# Altium schematic sheet G031_Dev.SchDoc
size A4
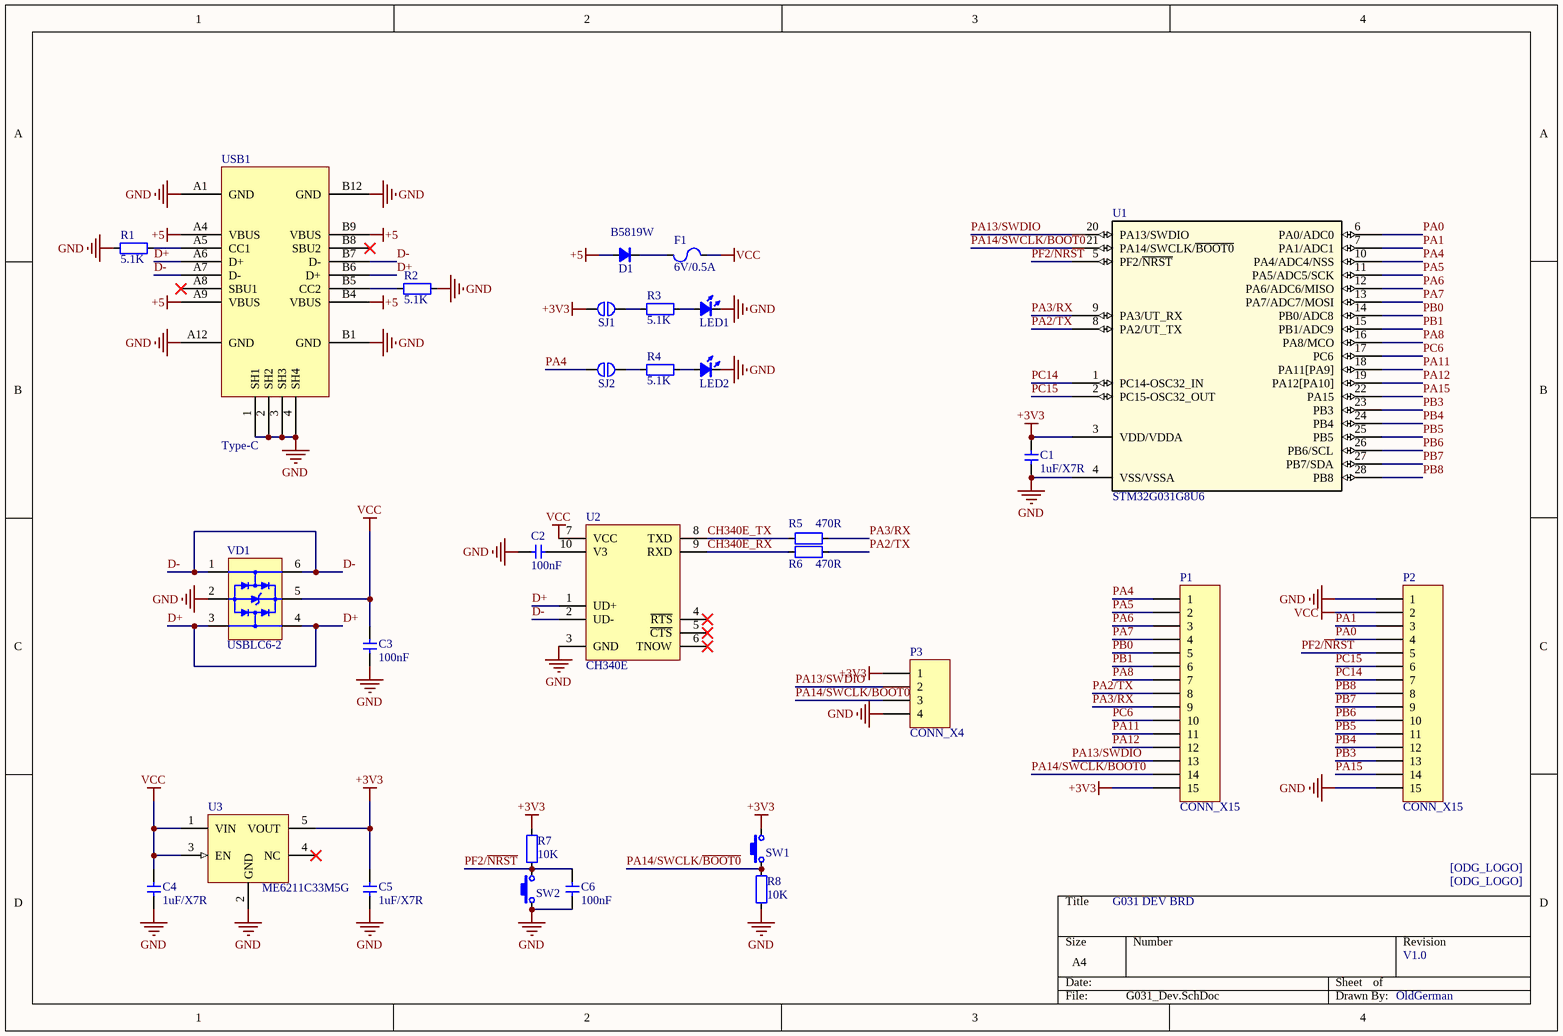
[diagram p0: G031_Dev.SchDoc]

## Parts
*1  ODG_LOGO  [ODG_LOGO]  (value not drawn)
*2  ODG_LOGO  [ODG_LOGO]  (value not drawn)
C1  1uF/X7R  [C0603]
C2  100nF  [C0603]
C3  100nF  [C0603]
C4  1uF/X7R  [C0603]
C5  1uF/X7R  [C0603]
C6  100nF  [C0603]
D1  B5819W  [SOD-323]
F1  6V/0.5A  [FUSE0603_0.5MM]
LED1  LED  [LED0603_GREEN]  (value not drawn)
LED2  LED  [LED0603_YELLOW]  (value not drawn)
P1  CONN_X15  [2.54MM_MALE_X15]
P2  CONN_X15  [2.54MM_MALE_X15]
P3  CONN_X4  [2.54mm_Male_x4]
R1  5.1K  [R0603]
R2  5.1K  [R0603]
R3  5.1K  [R0603]
R4  5.1K  [R0603]
R5  470R  [R0603]
R6  470R  [R0603]
R7  10K  [R0603]
R8  10K  [R0603]
SJ1  SJ_2P  [SJ_2P_MINI]  (value not drawn)
SJ2  SJ_2P  [SJ_2P_MINI]  (value not drawn)
SW1  Button-2P  [SWITCH_3X4_SMD]  (value not drawn)
SW2  Button-2P  [SWITCH_3X4_SMD]  (value not drawn)
U1  STM32G031G8U6  [UFQFPN28-4x4mm_ODG]
U2  CH340E  [TI MSOP-10 DGS]
U3  ME6211C33M5G  [ANALOG TSOT-23-5 UJ-5]
USB1  Type-C  [Type-C-TOP]
VD1  USBLC6-2  [MICROCHIP SOT-23-6 M6]

## Nets
+3V3: C1.1 C5.2 P1.15 P3.1 R7.1 SJ1.1 SW1.2 U1.3(VDD/VDDA) U3.5(VOUT)
+5: D1.1(A) USB1.A4(VBUS) USB1.A9(VBUS) USB1.B4(VBUS) USB1.B9(VBUS)
GND: C1.2 C2.1 C3.1 C4.1 C5.1 C6.1 LED1.2(K) LED2.2(K) P2.1 P2.15 P3.4 R1.1 R2.2 R8.2 SW2.1 U1.4(VSS/VSSA) U2.3(GND) U3.2(GND) USB1.1(SH1) USB1.2(SH2) USB1.3(SH3) USB1.4(SH4) USB1.A1(GND) USB1.A12(GND) USB1.B1(GND) USB1.B12(GND) VD1.2(GND)
VCC: C3.2 C4.2 F1.2 P2.2 U2.7(VCC) U3.1(VIN) U3.3(EN) VD1.5(VBUS)
CH340E_RX: R6.1 U2.9(RXD)
CH340E_TX: R5.1 U2.8(TXD)
D+: U2.1(UD+) USB1.A6(D+) USB1.B6(D+) VD1.3(I/O2) VD1.4(I/O2)
D-: U2.2(UD-) USB1.A7(D-) USB1.B7(D-) VD1.1(I/O1) VD1.6(I/O1)
PA0: P2.4 U1.6(PA0/ADC0)
PA1: P2.3 U1.7(PA1/ADC1)
PA2/TX: P1.8 R6.2 U1.8(PA2/UT_TX)
PA3/RX: P1.9 R5.2 U1.9(PA3/UT_RX)
PA4: P1.1 SJ2.1 U1.10(PA4/ADC4/NSS)
PA5: P1.2 U1.11(PA5/ADC5/SCK)
PA6: P1.3 U1.12(PA6/ADC6/MISO)
PA7: P1.4 U1.13(PA7/ADC7/MOSI)
PA8: P1.7 U1.16(PA8/MCO)
PA11: P1.11 U1.18(PA11[PA9])
PA12: P1.12 U1.19(PA12[PA10])
PA13/SWDIO: P1.13 P3.2 U1.20(PA13/SWDIO)
PA14/SWCLK/~{BOOT0}: P1.14 P3.3 R8.1 SW1.1 U1.21(PA14/SWCLK/~{BOOT0})
PA15: P2.14 U1.22(PA15)
PB0: P1.5 U1.14(PB0/ADC8)
PB1: P1.6 U1.15(PB1/ADC9)
PB3: P2.13 U1.23(PB3)
PB4: P2.12 U1.24(PB4)
PB5: P2.11 U1.25(PB5)
PB6: P2.10 U1.26(PB6/SCL)
PB7: P2.9 U1.27(PB7/SDA)
PB8: P2.8 U1.28(PB8)
PC6: P1.10 U1.17(PC6)
PC14: P2.7 U1.1(PC14-OSC32_IN)
PC15: P2.6 U1.2(PC15-OSC32_OUT)
PF2/~{NRST}: C6.2 P2.5 R7.2 SW2.2 U1.5(PF2/~{NRST})
NetC2_2: C2.2 U2.10(V3)
NetD1_2: D1.2(C) F1.1
NetLED1_1: LED1.1(A) R3.2
NetLED2_1: LED2.1(A) R4.2
NetR1_2: R1.2 USB1.A5(CC1)
NetR2_1: R2.1 USB1.B5(CC2)
NetR3_1: R3.1 SJ1.2
NetR4_1: R4.1 SJ2.2

Not connected (* = marked no-connect by the designer): U2 4(~{RTS})* 5(~{CTS})* 6(TNOW)*; U3 4(NC)*; USB1 A8(SBU1)* B8(SBU2)*

## Notes on the sheet
- G031 DEV BRD
- V1.0
- OldGerman
- (in symbol ODG_LOGO) [ODG_LOGO]

## Library data of the parts
C1-C6 = CAP: Capacitor; Value: 0.1u
D1 = DIODE: 二极管
F1 = FUSE: 贴片自恢复保险丝
LED1 LED2 = LED: Value: color?
R1-R8 = RES: Resistor; Value: 22R
SJ1 SJ2 = SJ_2P: 焊接跳线
SW1 SW2 = Button-2P: Button
U1 = STM32G031G8U6: No Description Available; Mfr_Name: STMicroelectronics; Copyright: Copyright (C) 2022 Ultra Librarian. All rights reserved.; Manufacturer_Part_Number: STM32G031G8U6; RefDes: RefDes; Type: DEV
U3 = ME6211C33M5G: 线性稳压芯片; BOM名称: 可调升压芯片; 版权归属: 源创客; 学习资源: www.ooocke.com
USB1 = USB-Type-C_16P
VD1 = USBLC6-2: Very low capacitance ESD protection / Features / • 2 data-line protection / • Protects VBUS / • Very low capacitance: 3.5 pF max. / • Very low leakage current: 150 nA max. / • SOT-666 and SOT23-6L packages / • RoHS compliant; BOM名称: 钳位IC; 版权归属: 源创客; 属性: 30V/0.2A; 学习资源: www.ooocke.com